# Altium schematic sheet RGB_Matrix.SchDoc
size A
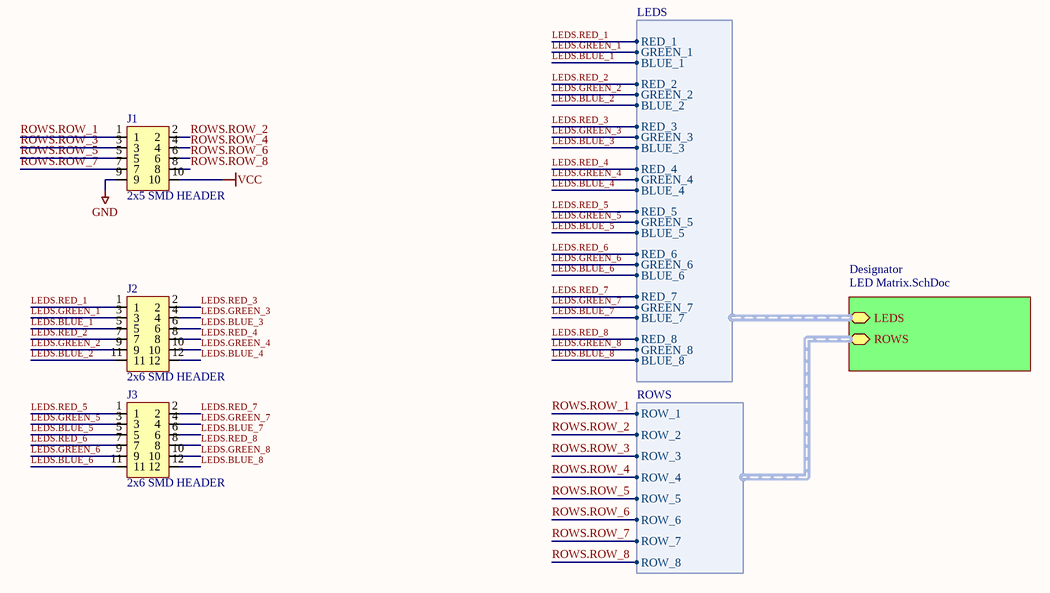
[diagram p0: RGB_Matrix.SchDoc]

## Parts
J1  2x5 SMD HEADER  [2x5 SMD HEADER]
J2  2x6 SMD HEADER  [2x6 SMD HEADER]
J3  2x6 SMD HEADER  [2x6 SMD HEADER]

## Sub-sheets
Designator = LED Matrix.SchDoc: LEDS (harness LEDS), ROWS (harness ROWS)

## Harnesses
LEDS: BLUE_1, BLUE_2, BLUE_3, BLUE_4, BLUE_5, BLUE_6, BLUE_7, GREEN_1, GREEN_2, GREEN_3, GREEN_4, GREEN_5, GREEN_6, GREEN_7, GREEN_8, RED_1, RED_2, RED_3, RED_4, RED_5, RED_6, RED_7, RED_8, BLUE_8
ROWS: ROW_1, ROW_2, ROW_3, ROW_4, ROW_5, ROW_6, ROW_7, ROW_8

## Nets
GND: J1.9
VCC: J1.10
LEDS.BLUE_1: J2.5 ; sheet Designator/LEDS.BLUE_1
LEDS.BLUE_2: J2.11 ; sheet Designator/LEDS.BLUE_2
LEDS.BLUE_3: J2.6 ; sheet Designator/LEDS.BLUE_3
LEDS.BLUE_4: J2.12 ; sheet Designator/LEDS.BLUE_4
LEDS.BLUE_5: J3.5 ; sheet Designator/LEDS.BLUE_5
LEDS.BLUE_6: J3.11 ; sheet Designator/LEDS.BLUE_6
LEDS.BLUE_7: J3.6 ; sheet Designator/LEDS.BLUE_7
LEDS.BLUE_8: J3.12 ; sheet Designator/LEDS.BLUE_8
LEDS.GREEN_1: J2.3 ; sheet Designator/LEDS.GREEN_1
LEDS.GREEN_2: J2.9 ; sheet Designator/LEDS.GREEN_2
LEDS.GREEN_3: J2.4 ; sheet Designator/LEDS.GREEN_3
LEDS.GREEN_4: J2.10 ; sheet Designator/LEDS.GREEN_4
LEDS.GREEN_5: J3.3 ; sheet Designator/LEDS.GREEN_5
LEDS.GREEN_6: J3.9 ; sheet Designator/LEDS.GREEN_6
LEDS.GREEN_7: J3.4 ; sheet Designator/LEDS.GREEN_7
LEDS.GREEN_8: J3.10 ; sheet Designator/LEDS.GREEN_8
LEDS.RED_1: J2.1 ; sheet Designator/LEDS.RED_1
LEDS.RED_2: J2.7 ; sheet Designator/LEDS.RED_2
LEDS.RED_3: J2.2 ; sheet Designator/LEDS.RED_3
LEDS.RED_4: J2.8 ; sheet Designator/LEDS.RED_4
LEDS.RED_5: J3.1 ; sheet Designator/LEDS.RED_5
LEDS.RED_6: J3.7 ; sheet Designator/LEDS.RED_6
LEDS.RED_7: J3.2 ; sheet Designator/LEDS.RED_7
LEDS.RED_8: J3.8 ; sheet Designator/LEDS.RED_8
ROWS.ROW_1: J1.1 ; sheet Designator/ROWS.ROW_1
ROWS.ROW_2: J1.2 ; sheet Designator/ROWS.ROW_2
ROWS.ROW_3: J1.3 ; sheet Designator/ROWS.ROW_3
ROWS.ROW_4: J1.4 ; sheet Designator/ROWS.ROW_4
ROWS.ROW_5: J1.5 ; sheet Designator/ROWS.ROW_5
ROWS.ROW_6: J1.6 ; sheet Designator/ROWS.ROW_6
ROWS.ROW_7: J1.7 ; sheet Designator/ROWS.ROW_7
ROWS.ROW_8: J1.8 ; sheet Designator/ROWS.ROW_8